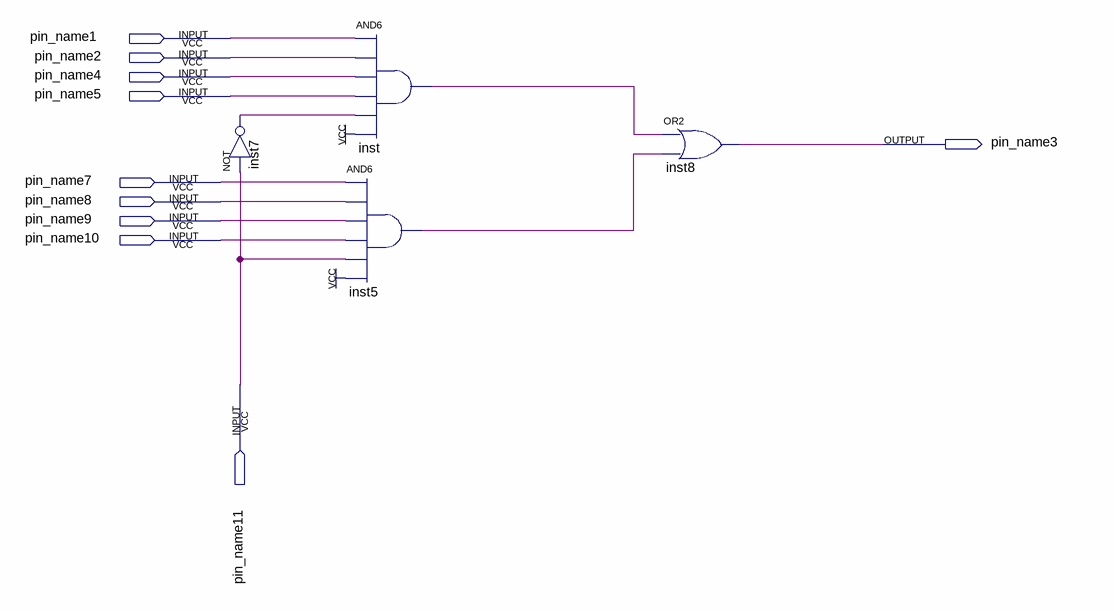
[diagram p0: schematic sheet]
// Quartus schematic mux.bdf as structural Verilog: 4 symbols, 10 pins
module mux (
  input  pin_name1,
  input  pin_name2,
  input  pin_name4,
  input  pin_name5,
  input  pin_name7,
  input  pin_name8,
  input  pin_name9,
  input  pin_name10,
  input  pin_name11,
  output pin_name3
);

  wire inst5_out, inst7_out, inst_out;

  not inst7 (inst7_out, pin_name11);
  and inst (inst_out, pin_name1, pin_name2, pin_name4, pin_name5, inst7_out, 1'b1);
  and inst5 (inst5_out, pin_name7, pin_name8, pin_name9, pin_name10, pin_name11, 1'b1);
  or inst8 (pin_name3, inst_out, inst5_out);
endmodule
